# EAGLE schematic Oric Tactile KB 1.1 (EAGLE 6.5.0)

## Sheet 1 of 2: Interface Logic
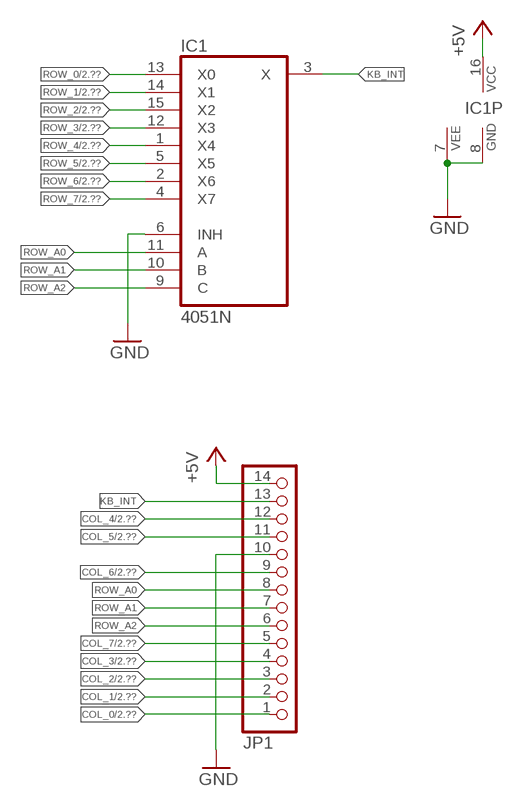
[diagram p0: schematic, sheet 1]

### Parts
IC1  4051N  [DIL16]
JP1  PINHD-1X14  [1X14]

### Nets
+5V: IC1.16(VCC) JP1.14
COL_0: JP1.1 ; also sheet 2
COL_1: JP1.2 ; also sheet 2
COL_2: JP1.3 ; also sheet 2
COL_3: JP1.4 ; also sheet 2
COL_4: JP1.12 ; also sheet 2
COL_5: JP1.11 ; also sheet 2
COL_6: JP1.9 ; also sheet 2
COL_7: JP1.5 ; also sheet 2
GND: IC1.6(INH) IC1.7(VEE) IC1.8(GND) JP1.10
KB_INT: IC1.3(X) JP1.13
ROW_0: IC1.13(X0) ; also sheet 2
ROW_1: IC1.14(X1) ; also sheet 2
ROW_2: IC1.15(X2) ; also sheet 2
ROW_3: IC1.12(X3) ; also sheet 2
ROW_4: IC1.1(X4) ; also sheet 2
ROW_5: IC1.5(X5) ; also sheet 2
ROW_6: IC1.2(X6) ; also sheet 2
ROW_7: IC1.4(X7) ; also sheet 2
ROW_A0: IC1.11(A) JP1.8
ROW_A1: IC1.10(B) JP1.7
ROW_A2: IC1.9(C) JP1.6

## Sheet 2 of 2: Matrix
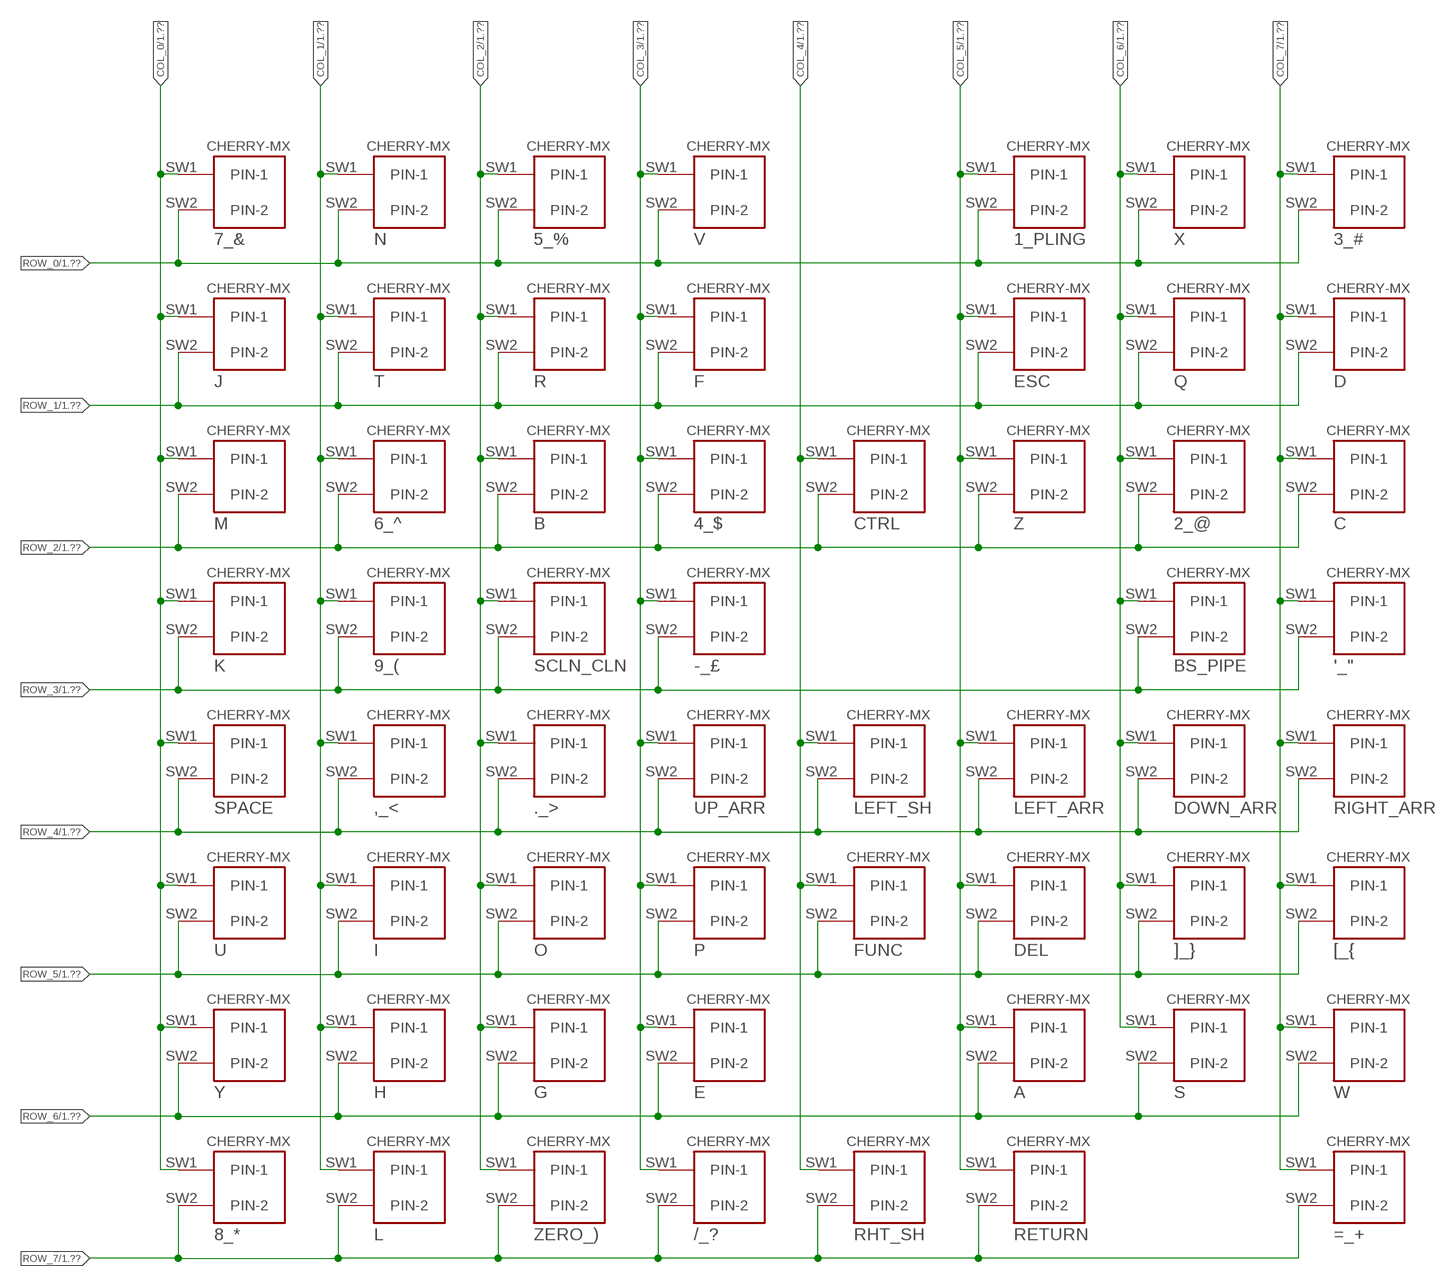
[diagram p1: schematic, sheet 2]

### Parts
1_PLING  CHERRY-MX  [CHERRY-MX]
2_@  CHERRY-MX  [CHERRY-MX]
3_#  CHERRY-MX  [CHERRY-MX]
4_$  CHERRY-MX  [CHERRY-MX]
5_%  CHERRY-MX  [CHERRY-MX]
6_^  CHERRY-MX  [CHERRY-MX]
7_&  CHERRY-MX  [CHERRY-MX]
8_*  CHERRY-MX  [CHERRY-MX]
9_(  CHERRY-MX  [CHERRY-MX]
'_"  CHERRY-MX  [CHERRY-MX]
,_<  CHERRY-MX  [CHERRY-MX]
-_£  CHERRY-MX  [CHERRY-MX]
._>  CHERRY-MX  [CHERRY-MX]
/_?  CHERRY-MX  [CHERRY-MX]
=_+  CHERRY-MX  [CHERRY-MX]
[_{  CHERRY-MX  [CHERRY-MX]
]_}  CHERRY-MX  [CHERRY-MX]
A  CHERRY-MX  [CHERRY-MX]
B  CHERRY-MX  [CHERRY-MX]
BS_PIPE  CHERRY-MX  [CHERRY-MX]
C  CHERRY-MX  [CHERRY-MX]
CTRL  CHERRY-MX  [CHERRY-MX]
D  CHERRY-MX  [CHERRY-MX]
DEL  CHERRY-MX  [CHERRY-MX]
DOWN_ARR  CHERRY-MX  [CHERRY-MX]
E  CHERRY-MX  [CHERRY-MX]
ESC  CHERRY-MX  [CHERRY-MX]
F  CHERRY-MX  [CHERRY-MX]
FUNC  CHERRY-MX  [CHERRY-MX]
G  CHERRY-MX  [CHERRY-MX]
H  CHERRY-MX  [CHERRY-MX]
I  CHERRY-MX  [CHERRY-MX]
J  CHERRY-MX  [CHERRY-MX]
K  CHERRY-MX  [CHERRY-MX]
L  CHERRY-MX  [CHERRY-MX]
LEFT_ARR  CHERRY-MX  [CHERRY-MX]
LEFT_SH  CHERRY-MX  [CHERRY-MX]
M  CHERRY-MX  [CHERRY-MX]
N  CHERRY-MX  [CHERRY-MX]
O  CHERRY-MX  [CHERRY-MX]
P  CHERRY-MX  [CHERRY-MX]
Q  CHERRY-MX  [CHERRY-MX]
R  CHERRY-MX  [CHERRY-MX]
RETURN  CHERRY-MX  [CHERRY-MX]
RHT_SH  CHERRY-MX  [CHERRY-MX]
RIGHT_ARR  CHERRY-MX  [CHERRY-MX]
S  CHERRY-MX  [CHERRY-MX]
SCLN_CLN  CHERRY-MX  [CHERRY-MX]
SPACE  CHERRY-MX  [CHERRY-MX]
T  CHERRY-MX  [CHERRY-MX]
U  CHERRY-MX  [CHERRY-MX]
UP_ARR  CHERRY-MX  [CHERRY-MX]
V  CHERRY-MX  [CHERRY-MX]
W  CHERRY-MX  [CHERRY-MX]
X  CHERRY-MX  [CHERRY-MX]
Y  CHERRY-MX  [CHERRY-MX]
Z  CHERRY-MX  [CHERRY-MX]
ZERO_)  CHERRY-MX  [CHERRY-MX]

### Nets
COL_0: 7_&.SW1(PIN-1) 8_*.SW1(PIN-1) J.SW1(PIN-1) K.SW1(PIN-1) M.SW1(PIN-1) SPACE.SW1(PIN-1) U.SW1(PIN-1) Y.SW1(PIN-1) ; also sheet 1
COL_1: 6_^.SW1(PIN-1) 9_(.SW1(PIN-1) ,_<.SW1(PIN-1) H.SW1(PIN-1) I.SW1(PIN-1) L.SW1(PIN-1) N.SW1(PIN-1) T.SW1(PIN-1) ; also sheet 1
COL_2: 5_%.SW1(PIN-1) ._>.SW1(PIN-1) B.SW1(PIN-1) G.SW1(PIN-1) O.SW1(PIN-1) R.SW1(PIN-1) SCLN_CLN.SW1(PIN-1) ZERO_).SW1(PIN-1) ; also sheet 1
COL_3: 4_$.SW1(PIN-1) -_£.SW1(PIN-1) /_?.SW1(PIN-1) E.SW1(PIN-1) F.SW1(PIN-1) P.SW1(PIN-1) UP_ARR.SW1(PIN-1) V.SW1(PIN-1) ; also sheet 1
COL_4: CTRL.SW1(PIN-1) FUNC.SW1(PIN-1) LEFT_SH.SW1(PIN-1) RHT_SH.SW1(PIN-1) ; also sheet 1
COL_5: 1_PLING.SW1(PIN-1) A.SW1(PIN-1) DEL.SW1(PIN-1) ESC.SW1(PIN-1) LEFT_ARR.SW1(PIN-1) RETURN.SW1(PIN-1) Z.SW1(PIN-1) ; also sheet 1
COL_6: 2_@.SW1(PIN-1) ]_}.SW1(PIN-1) BS_PIPE.SW1(PIN-1) DOWN_ARR.SW1(PIN-1) Q.SW1(PIN-1) S.SW1(PIN-1) X.SW1(PIN-1) ; also sheet 1
COL_7: 3_#.SW1(PIN-1) '_".SW1(PIN-1) =_+.SW1(PIN-1) [_{.SW1(PIN-1) C.SW1(PIN-1) D.SW1(PIN-1) RIGHT_ARR.SW1(PIN-1) W.SW1(PIN-1) ; also sheet 1
ROW_0: 1_PLING.SW2(PIN-2) 3_#.SW2(PIN-2) 5_%.SW2(PIN-2) 7_&.SW2(PIN-2) N.SW2(PIN-2) V.SW2(PIN-2) X.SW2(PIN-2) ; also sheet 1
ROW_1: D.SW2(PIN-2) ESC.SW2(PIN-2) F.SW2(PIN-2) J.SW2(PIN-2) Q.SW2(PIN-2) R.SW2(PIN-2) T.SW2(PIN-2) ; also sheet 1
ROW_2: 2_@.SW2(PIN-2) 4_$.SW2(PIN-2) 6_^.SW2(PIN-2) B.SW2(PIN-2) C.SW2(PIN-2) CTRL.SW2(PIN-2) M.SW2(PIN-2) Z.SW2(PIN-2) ; also sheet 1
ROW_3: 9_(.SW2(PIN-2) '_".SW2(PIN-2) -_£.SW2(PIN-2) BS_PIPE.SW2(PIN-2) K.SW2(PIN-2) SCLN_CLN.SW2(PIN-2) ; also sheet 1
ROW_4: ,_<.SW2(PIN-2) ._>.SW2(PIN-2) DOWN_ARR.SW2(PIN-2) LEFT_ARR.SW2(PIN-2) LEFT_SH.SW2(PIN-2) RIGHT_ARR.SW2(PIN-2) SPACE.SW2(PIN-2) UP_ARR.SW2(PIN-2) ; also sheet 1
ROW_5: [_{.SW2(PIN-2) ]_}.SW2(PIN-2) DEL.SW2(PIN-2) FUNC.SW2(PIN-2) I.SW2(PIN-2) O.SW2(PIN-2) P.SW2(PIN-2) U.SW2(PIN-2) ; also sheet 1
ROW_6: A.SW2(PIN-2) E.SW2(PIN-2) G.SW2(PIN-2) H.SW2(PIN-2) S.SW2(PIN-2) W.SW2(PIN-2) Y.SW2(PIN-2) ; also sheet 1
ROW_7: 8_*.SW2(PIN-2) /_?.SW2(PIN-2) =_+.SW2(PIN-2) L.SW2(PIN-2) RETURN.SW2(PIN-2) RHT_SH.SW2(PIN-2) ZERO_).SW2(PIN-2) ; also sheet 1

## Library data of the parts
1_PLING 2_@ 3_# 4_$ 5_% 6_^ 7_& 8_* 9_( '_" ,_< -_£ ._> /_? =_+ [_{ ]_} A B BS_PIPE C CTRL D DEL DOWN_ARR E ESC F FUNC G H I J K L LEFT_ARR LEFT_SH M N O P Q R RETURN RHT_SH RIGHT_ARR S SCLN_CLN SPACE T U UP_ARR V W X Y Z ZERO_) = cherrymx:CHERRY-MX: Cherry MX series keyswitch
IC1 = 40xx:4051: 8-channel ANALOG MULTIPLEXER
JP1 = pinhead:PINHD-1X14: PIN HEADER

## Net classes
0 default: width 0.61 mm, clearance 0.254 mm